# EAGLE design Longbow Widget (EAGLE 9.5.2)
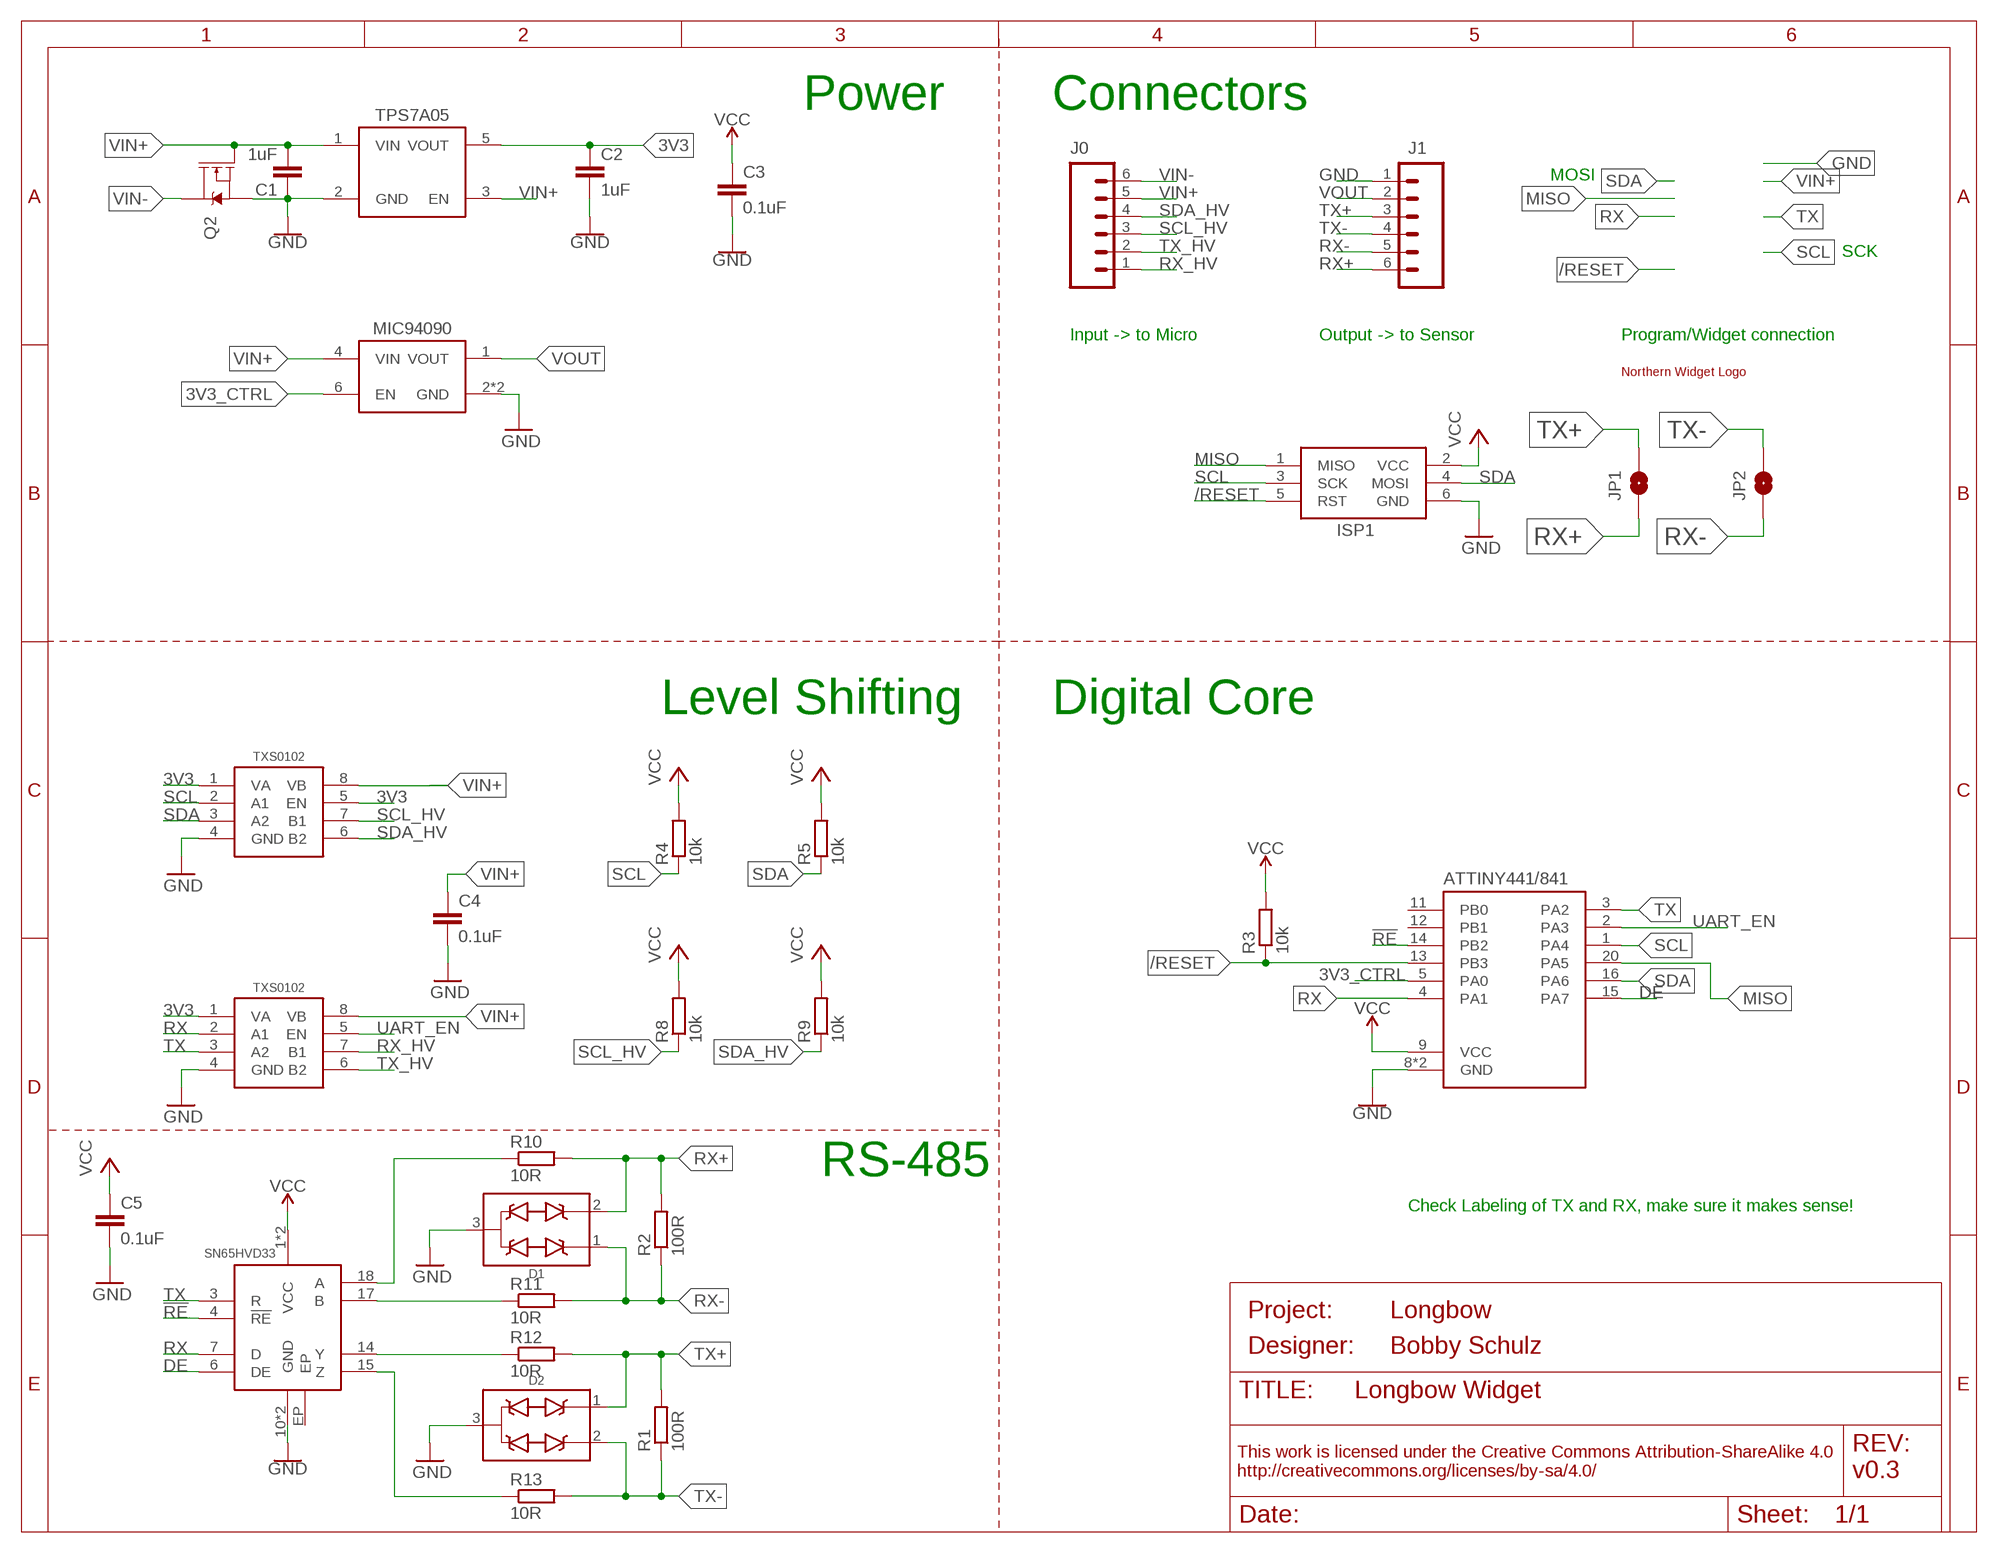
[diagram p0: schematic, sheet 1]
FRAME1 (FRAME_A_L): DESIGNER: Bobby Schulz; PROJECT: Longbow; REV: v0.3

## Parts
C1  1uF  C-EU1UFC0603  [C0603]
C2  1uF  C-EU1UFC0603  [C0603]
C3  0.1uF  C-EU0.1UFC0402  [C0402]
C4  0.1uF  C-EU0.1UFC0402  [C0402]
C5  0.1uF  C-EU0.1UFC0402  [C0402]
D1  TVSSM712  [SOT23-3]
D2  TVSSM712  [SOT23-3]
ISP1  AVRISP1.27MM  [2X3_1.27]
J0  CONN_6SCREW_2.54  [1X06_SCREW]
J1  CONN_6SCREW_2.54  [1X06_SCREW]
JP1  JUMPER-SMT_2_NO_SILK  [SMT-JUMPER_2_NO_SILK]
JP2  JUMPER-SMT_2_NO_SILK  [SMT-JUMPER_2_NO_SILK]
Q2  DMG3404  MOSFET-NCH-DMG3404L  [SOT23-3]
R1  100R  R-EU_100R0402  [R0402]
R2  100R  R-EU_100R0402  [R0402]
R3  10k  R-EU_10KR0402  [R0402]
R4  10k  R-EU_10KR0402  [R0402]
R5  10k  R-EU_10KR0402  [R0402]
R8  10k  R-EU_10KR0402  [R0402]
R9  10k  R-EU_10KR0402  [R0402]
R10  10R  R-EU_R0603  [R0603]
R11  10R  R-EU_R0603  [R0603]
R12  10R  R-EU_R0603  [R0603]
R13  10R  R-EU_R0603  [R0603]
U1  TPS7A0533DBV  [SOT23-5]
U2  SN65HVD33RHL  [VQFN-20_POWER]
U$1  MIC94090C6  [SC-70_6]
U$2  ATTINY441/841VQFN  [VQFN-20]
U$3  TXS0102DQM  [DQM_R-PX2SON-N8]
U$4  NWLOGO_MED  [NWLOGO_MED]
U$6  TXS0102DQM  [DQM_R-PX2SON-N8]

## Nets
3V3: C2.1 C3.1 C5.1 ISP1.2(VCC) R3.2 R4.2 R5.2 U1.5(VOUT) U2.1(VCC) U2.20(VCC) U$2.9(VCC) U$3.1(VA) U$3.5(EN) U$6.1(VA) ; supply symbol labelled VCC
3V3_CTRL: U$1.6(EN) U$2.5(PA0)
!RE: U2.4(!RE) U$2.14(PB2)
/RESET: ISP1.5(RST) R3.1 U$2.13(PB3)
DE: U2.6(DE) U$2.15(PA7)
GND: C1.1 C2.2 C3.2 C4.2 C5.2 D1.3(COM) D2.3(COM) ISP1.6(GND) J1.1 Q2.2(S) U1.2(GND) U2.10(GND) U2.11(GND) U$1.2(GND) U$1.5(GND) U$2.8(GND) U$2.EP(GND) U$3.4(GND) U$6.4(GND)
MISO: ISP1.1(MISO) U$2.20(PA5)
N$2: R10.1 U2.18(A)
N$5: R11.1 U2.17(B)
N$6: R12.1 U2.14(Y)
N$7: R13.1 U2.15(Z)
RX: U2.7(D) U$2.4(PA1) U$6.2(A1)
RX+: D1.2(D2) J1.6 JP1.1 R2.2 R10.2
RX-: D1.1(D1) J1.5 JP2.1 R2.1 R11.2
RX_HV: J0.1 U$6.7(B1)
SCL: ISP1.3(SCK) R4.1 U$2.1(PA4) U$3.2(A1)
SCL_HV: J0.3 R8.1 U$3.7(B1)
SDA: ISP1.4(MOSI) R5.1 U$2.16(PA6) U$3.3(A2)
SDA_HV: J0.4 R9.1 U$3.6(B2)
TX: U2.3(R) U$2.3(PA2) U$6.3(A2)
TX+: D2.1(D1) J1.3 JP1.2 R1.2 R12.2
TX-: D2.2(D2) J1.4 JP2.2 R1.1 R13.2
TX_HV: J0.2 U$6.6(B2)
UART_EN: U$2.2(PA3) U$6.5(EN)
VIN+: C1.2 C4.1 J0.5 Q2.1(G) R8.2 R9.2 U1.1(VIN) U1.3(EN) U$1.4(VIN) U$3.8(VB) U$6.8(VB) ; supply symbol labelled VCC
VIN-: J0.6 Q2.3(D)
VOUT: J1.2 U$1.1(VOUT)
Unconnected: U2.EP U$2.11(PB0) U$2.12(PB1)

## Notes on the sheet
- Power | Connectors
- MOSI
- SCK
- Input -> to Micro | Output -> to Sensor | Program/Widget connection
- Level Shifting | Digital Core
- RS-485
- Check Labeling of TX and RX, make sure it makes sense!

## Library data of the parts
C1 C2 = bschulz_passives:C-EU: CAPACITOR, European symbol; DIGIKEY: 490-10479-1-ND; MF: Murata; MPN: GRM188R61C105KA12D
C3-C5 = bschulz_passives:C-EU: CAPACITOR, European symbol; DIGIKEY: 490-4759-1-ND; MF: Murata; MPN: GCM155R71C104KA55D
D1 D2 = bschulz:TVS: Generic dual channel TVS diode; DIGIKEY: CDSOT23-SM712CT-ND; MF: Bourns; MPN: CDSOT23-SM712
ISP1 = bschulz:AVRISP: AVR ISP HEADER Standard 6 pin header for AVR programming
J0 J1 = bschulz:CONN_6: Genaric 6 pin header; DIGIKEY: ED10565-ND; MF: OnShore; MPN: OSTVN06A150
JP1 JP2 = SparkFun-Jumpers:JUMPER-SMT_2_NO: Normally open jumper This jumper has two pads in close proximity to each other. Apply solder to close the connection. Round pads are easier to solder for beginners, but are a lot larger. SparkFun Product that uses the round pads: SparkFun EL Sequencer <https://www.sparkfun.com/products/12781>
Q2 = bschulz:MOSFET-NCH: N-channel MOSFETs Voltage controlled devices that allow control of high current outputs. SparkFun Products: SparkFun OpenScale <https://www.sparkfun.com/products/13261> SparkFun Digital Sandbox <https://www.sparkfun.com/products/12651> SparkFun Monster Moto Shield <https://www.sparkfun.com/products/10182> SparkFun MOSFET Power Controller <https://www.sparkfun.com/products/11214>; DIGIKEY: DMG3404L-7DICT-ND; MF: Diodes Incorporated; MPN: DMG3404L-7
R1 R2 = bschulz_passives:R-EU_: RESISTOR, European symbol Digikey Parts: Yageo, 0402 <https://www.digikey.com/products/en/resistors/chip-resistor-surface-mount/52?k=&pkeyword=&sf=0&FV=ffec1104%2Cfffc000d%2C1c0002%2C440067%2C1f140000%2Cffe00034%2C400004&quantity=&ColumnSort=0&page=1&stock=1&pageSize=25> Yageo, 0603 <https://www.digikey.com/products/en/resistors/chip-resistor-surface-mount/52?k=&pkeyword=&s=4356&s=47360&sf=0&FV=fffc000d%2C1c0002%2C142c040c%2C1f140000%2Cffe00034&quantity=10&ColumnSort=1000011&page=1&stock=1&pageSize=25> Panasonic, precision, 0603 <https://www.digikey.com/products/en/resistors/chip-resistor-surface-mount/52?FV=ffec4907%2Cfffc000a%2Cc0172%2C142c040c%2C1f140000%2Cffe00034%2C1c0002&quantity=100&ColumnSort=2085&page=1&stock=1&pageSize=25> Vishay, pulse proof automotive <https://www.digikey.com/products/en/resistors/chip-resistor-surface-mount/52?k=&pkeyword=&pv7=2&sf=0&FV=ffec5d6b%2Cffe00034%2C1f140000&quantity=&ColumnSort=0&page=1&stock=1&pageSize=25>; DIGIKEY: 311-100LRCT-ND; MF: Yageo; MPN: RC0402FR-07100RL; VALUE_PART: 100
R3-R5 R8 R9 = bschulz_passives:R-EU_: RESISTOR, European symbol Digikey Parts: Yageo, 0402 <https://www.digikey.com/products/en/resistors/chip-resistor-surface-mount/52?k=&pkeyword=&sf=0&FV=ffec1104%2Cfffc000d%2C1c0002%2C440067%2C1f140000%2Cffe00034%2C400004&quantity=&ColumnSort=0&page=1&stock=1&pageSize=25> Yageo, 0603 <https://www.digikey.com/products/en/resistors/chip-resistor-surface-mount/52?k=&pkeyword=&s=4356&s=47360&sf=0&FV=fffc000d%2C1c0002%2C142c040c%2C1f140000%2Cffe00034&quantity=10&ColumnSort=1000011&page=1&stock=1&pageSize=25> Panasonic, precision, 0603 <https://www.digikey.com/products/en/resistors/chip-resistor-surface-mount/52?FV=ffec4907%2Cfffc000a%2Cc0172%2C142c040c%2C1f140000%2Cffe00034%2C1c0002&quantity=100&ColumnSort=2085&page=1&stock=1&pageSize=25> Vishay, pulse proof automotive <https://www.digikey.com/products/en/resistors/chip-resistor-surface-mount/52?k=&pkeyword=&pv7=2&sf=0&FV=ffec5d6b%2Cffe00034%2C1f140000&quantity=&ColumnSort=0&page=1&stock=1&pageSize=25>; DIGIKEY: 311-10KJRCT-ND; MF: Yageo; MPN: RC0402JR-0710KL; VALUE_PART: 10k
R10-R13 = bschulz_passives:R-EU_: RESISTOR, European symbol Digikey Parts: Yageo, 0402 <https://www.digikey.com/products/en/resistors/chip-resistor-surface-mount/52?k=&pkeyword=&sf=0&FV=ffec1104%2Cfffc000d%2C1c0002%2C440067%2C1f140000%2Cffe00034%2C400004&quantity=&ColumnSort=0&page=1&stock=1&pageSize=25> Yageo, 0603 <https://www.digikey.com/products/en/resistors/chip-resistor-surface-mount/52?k=&pkeyword=&s=4356&s=47360&sf=0&FV=fffc000d%2C1c0002%2C142c040c%2C1f140000%2Cffe00034&quantity=10&ColumnSort=1000011&page=1&stock=1&pageSize=25> Panasonic, precision, 0603 <https://www.digikey.com/products/en/resistors/chip-resistor-surface-mount/52?FV=ffec4907%2Cfffc000a%2Cc0172%2C142c040c%2C1f140000%2Cffe00034%2C1c0002&quantity=100&ColumnSort=2085&page=1&stock=1&pageSize=25> Vishay, pulse proof automotive <https://www.digikey.com/products/en/resistors/chip-resistor-surface-mount/52?k=&pkeyword=&pv7=2&sf=0&FV=ffec5d6b%2Cffe00034%2C1f140000&quantity=&ColumnSort=0&page=1&stock=1&pageSize=25>; DIGIKEY: 541-10.0SCT-ND; MF: Vishay; MPN: CRCW060310R0FKEAHP; VALUE_PART: 10
U1 = bschulz:TPS7A05*: TPS7A05* - Ultra Low Power Low Dropout Linear Regulator Characteristics: Vin: 1.4V ~ 5.5V Vout: 0.8, 1.0, 1.2, 1.5, 1.8, 2.5, 2.85, 3.3V fixed IQ: 1μA typ, 3μA max Voltage Accuracy: 1% typ, 3% max Output Current: 200 mA Operating Temperature: -40°C to 125°C Mouser: TPS7A0533 (3.3V Fixed) <https://www.mouser.com/ProductDetail/Texas-Instruments/TPS7A0533PDBVR?qs=sGAEpiMZZMsGz1a6aV8DcD1rpA6FsR3J1Mp5DdTpiXw%3d> TPS7A0518 (1.8V Fixed) <https://www.mouser.com/ProductDetail/Texas-Instruments/TPS7A0518PDBVR?qs=sGAEpiMZZMsGz1a6aV8DcD1rpA6FsR3J1f7DNYacdSI%3d>; DIGIKEY: 296-TPS7A0533PDBVRCT-ND; MF: TI; MOUSER: 595-TPS7A0533PDBVR; MPN: TPS7A0533PDBVR
U2 = bschulz:SN65HVD33: SN65HVD33 - Full Duplex RS-485 Tranciver, with output enable Characteristics: VCC: 3~3.6V Operating Temperature: -40°C to 85°C Signaling Rate: 1, 5, 26 Mbps (depending on model) Digikey: 296-24087-1-ND (RHL) <https://www.digikey.com/product-detail/en/texas-instruments/SN65HVD33RHLR/296-24087-1-ND/1991606> 296-18704-1-ND (D) <https://www.digikey.com/product-detail/en/texas-instruments/SN65HVD33DR/296-18704-1-ND/863533>; DIGIKEY: 296-24087-1-ND; MF: TI; MPN: SN65HVD33RHLR
U$1 = bschulz:MIC94090: MIC94090 - Hight Side Load Switch Characteristics: Vin: 1.7V ~ 5.5V IQ: 0.1μA typ, 1μA max RDS(ON): 130mΩ (Vin = 5v), 140mΩ (Vin = 3.6v) Output Current: 1.2 mA Operating Temperature: -40°C to 125°C Digikey: 576-3484-1-ND <https://www.digikey.com/products/en/integrated-circuits-ics/pmic-power-distribution-switches-load-drivers/726?k=mic94090&k=&pkeyword=mic94090&pv1291=38&sf=0&FV=ffe002d6%2C1c0002&quantity=&ColumnSort=0&page=1&stock=1&pageSize=25>; DIGIKEY: 576-3484-1-ND; MF: Microchip; MPN: MIC94090YC6-TR
U$2 = bschulz:ATTINY441/841: ATtiny841/441 8 bit AVR Microcontroller Features: (441/841) Vcc: 1.8 ~ 5.5V Clock: Up to 16MHz, Internal 8MHz FRC, 32kHz RC Flash Memory: 4/8K SRAM: 256/512B EEPROM: 256/512B ADC: 10b, 12 port USART: Yes, x2 SPI: Yes I2C: Yes, slave only Notes: 2 analog comp. Digikey: ATTINY841-MMHRCT-ND (VQFN) <https://www.digikey.com/product-detail/en/microchip-technology/ATTINY841-MMHR/ATTINY841-MMHRCT-ND/4437440> ATTINY841-SSU-ND (SOIC) <https://www.digikey.com/product-detail/en/microchip-technology/ATTINY841-SSU/ATTINY841-SSU-ND/4437435>; DIGIKEY: ATTINY841-MMHRCT-ND; MF: Atmel; MPN: ATTINY841-MMHR
U$3 U$6 = bschulz:TXS0102: TXS0102 - 2 Channel Bidirectional Voltage Level Translator Characteristics: Vcc: 1.65 ~ 3.6V (Port A), 2.3 ~ 5.5V (Port B) IQ: 14.4μA Output Current: 50mA Output Type: Open Drain/Push-Pull Operating Temperature: -40°C to 85°C Digikey: 296-28368-1-ND (DQE) <https://www.digikey.com/product-detail/en/texas-instruments/TXS0102DQER/296-28368-1-ND/2625893> 296-28435-1-ND (DQM) <https://www.digikey.com/product-detail/en/texas-instruments/TXS0102DQMR/296-28435-1-ND/2638910> 296-21931-1-ND (DCU) <https://www.digikey.com/product-detail/en/texas-instruments/TXS0102DCUR/296-21931-1-ND/1629284>; DIGIKEY: 296-28435-1-ND; MF: TI; MPN: TXS0102DQMR
U$4 = awickert:NWLOGO_MED: Medium-sized Northern Widget logo

## Board
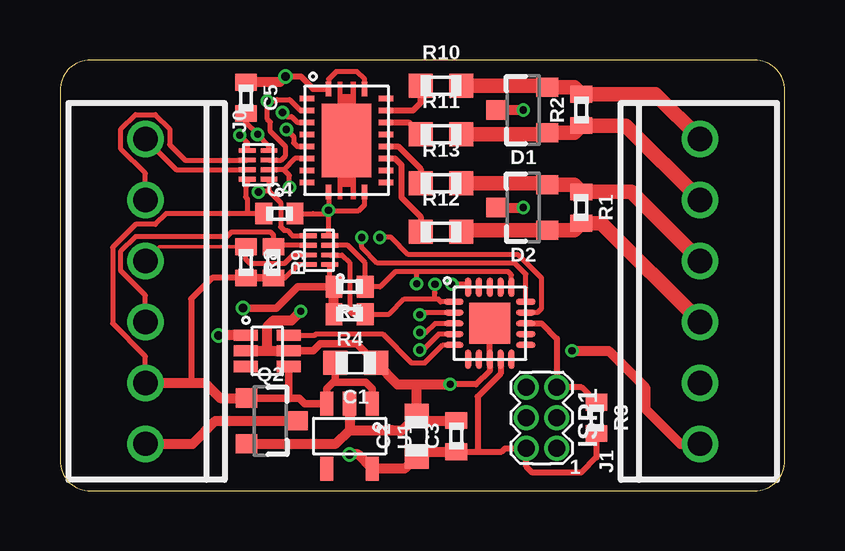
[diagram p1: board, top side]
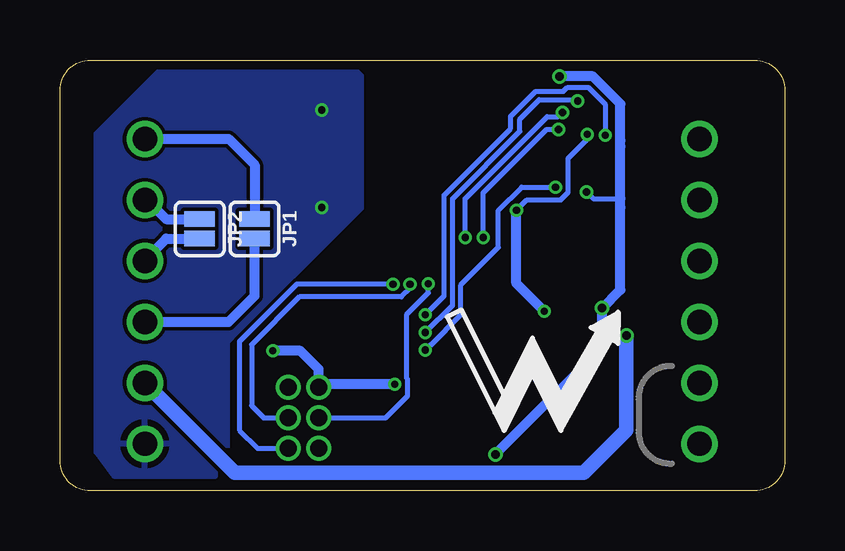
[diagram p2: board, bottom side, seen from below]

Size 30.21 x 17.96 mm. Coordinates in mm from the lower left corner, seen from the top.
Outline: 1.27,0 28.94,0 arc90 30.21,1.27 30.21,16.69 arc90 28.94,17.96 1.27,17.96 arc90 0,16.69 0,1.27 arc90 1.27,0
Copper layers (1*16): Top 0.035559375mm / dielectric 1.6mm / Bottom 0.035559375mm
Design rules "oshpark-2layer": minimum track width 6mil, minimum drill 10mil, track to track 6mil, track to pad 6mil, pad to pad 6mil, via to via 6mil, smd to smd 6mil, copper to edge 15mil, drill to drill 6mil, minimum pad ring 5mil, minimum via ring 5mil, stop-mask expansion 2.5mil, vias tented up to drill 0mil, thermal gap 10mil

### Footprints (pad centres in the part's own frame; a part is rotated, then mirrored left to right if it is on the bottom)
C0603 = smd 1 x 1: 1 -0.85,0; 2 0.85,0
C0402 = smd 0.7 x 0.9: 1 -0.65,0; 2 0.65,0
SOT23-3 = smd 0.8 x 0.9: 1 -0.95,-1; 2 0.95,-1; 3 0,1.1
2X3_1.27 = drill 0.7 pad 1.05: 1 -1.27,-0.635; 2 -1.27,0.635; 3 0,-0.635; 4 0,0.635; 5 1.27,-0.635; 6 1.27,0.635
1X06_SCREW = drill 1.016: 1 -6.35,0; 2 -3.81,0; 3 -1.27,0; 4 1.27,0; 5 3.81,0; 6 6.35,0
SMT-JUMPER_2_NO_SILK = smd 0.635 x 1.27: 1 -0.406,0; 2 0.406,0
R0402 = smd 0.7 x 0.9: 1 -0.65,0; 2 0.65,0
R0603 = smd 1 x 1: 1 -0.85,0; 2 0.85,0
SOT23-5 = smd 0.55 x 1: 1 -0.95,-1.35; 2 0,-1.35; 3 0.95,-1.35; 4 0.95,1.35; 5 -0.95,1.35
VQFN-20_POWER = smd 0.24 x 0.6: 1 -0.75,2.15; 10 -0.75,-2.15; 11 0.75,-2.15; 20 0.75,2.15 | smd 0.6 x 0.24: 2 -1.65,1.75; 3 -1.65,1.25; 4 -1.65,0.75; 5 -1.65,0.25; 6 -1.65,-0.25; 7 -1.65,-0.75; 8 -1.65,-1.25; 9 -1.65,-1.75; 12 1.65,-1.75; 13 1.65,-1.25; 14 1.65,-0.75; 15 1.65,-0.25; 16 1.65,0.25; 17 1.65,0.75; 18 1.65,1.25; 19 1.65,1.75 | smd 2.05 x 3.05: EP 0,0
SC-70_6 = smd 0.47 x 1: 1 -0.65,-0.9; 2 0,-0.9; 3 0.65,-0.9; 4 0.65,0.9; 5 0,0.9; 6 -0.65,0.9
VQFN-20 = smd 0.8 x 0.25: 1 -1.5,0.9; 2 -1.5,0.45; 3 -1.5,0; 4 -1.5,-0.45; 5 -1.5,-0.9; 11 1.5,-0.9; 12 1.5,-0.45; 13 1.5,0; 14 1.5,0.45; 15 1.5,0.9 | smd 0.25 x 0.8: 6 -0.9,-1.5; 7 -0.45,-1.5; 8 0,-1.5; 9 0.45,-1.5; 10 0.9,-1.5; 16 0.9,1.5; 17 0.45,1.5; 18 0,1.5; 19 -0.45,1.5; 20 -0.9,1.5 | smd 1.7 x 1.7: EP 0,0
DQM_R-PX2SON-N8 = smd 0.2 x 0.7: 1 -0.6,-0.45; 2 -0.2,-0.45; 3 0.2,-0.45; 4 0.6,-0.45; 5 0.6,0.45; 6 0.2,0.45; 7 -0.2,0.45; 8 -0.6,0.45

### Placement (x,y rotation side)
C1  12.32,5.33 180 top
C2  14.86,2.29 90 top
C3  16.51,2.29 90 top
C4  9.14,11.56 0 top
C5  7.75,16.38 270 top
D1  19.3,15.88 90 top
D2  19.3,11.81 90 top
ISP1  20.07,3.05 90 top
J0  3.56,8.32 270 top
J1  26.67,8.32 90 top
JP1  22.1,10.92 270 bottom
JP2  24.38,10.92 270 bottom
Q2  8.76,2.92 270 top
R1  21.72,11.81 270 top
R2  21.72,15.88 90 top
R3  22.35,3.05 270 top
R4  12.06,7.37 180 top
R5  12.06,8.51 180 top
R8  7.75,9.52 270 top
R9  8.89,9.52 270 top
R10  15.88,16.89 0 top
R11  15.88,14.86 0 top
R12  15.88,10.8 0 top
R13  15.88,12.83 0 top
U1  12.06,2.29 180 top
U2  11.94,14.61 0 top
U$1  8.64,5.84 270 top
U$2  17.91,6.98 0 top
U$3  10.79,10.03 90 top
U$4  10.54,5.46 0 bottom
U$6  8.26,13.59 90 top

### Tracks (layer width: path | path; a pad name or v marks a point on that pad's centre or on a via)
3V3  (via drill 0.3 pad 0.4, 0.35)
  Top 0.2: R5.2 11.25,8.68 U$3.1 | U$6.1 8.71,12.5 | 8.71,12.5 9.19,12.02 9.19,11 9.34,10.86 9.46,10.86 9.69,10.63 U$3.5 | v8.27,12.46 8.31,12.5 8.71,12.5 | U2.20 12.69,17.16 12.37,17.48 12.32,17.48 11.51,17.48 11.19,17.16 U2.1
  Top 0.254: U$2.9 18.36,4.89 17.4,3.94 17.4,1.65 17.4,1.64 | C3.1 16.89,1.64 17.4,1.64 | R3.2 22.35,1.4 21.72,0.76 19.69,0.76 19.43,1.02 ISP1.2 18.54,1.78 18.4,1.64 17.4,1.64 | v9.4,17.27 10.03,17.27 10.55,16.75 U2.1
  Top 0.305: v7.62,7.62 9.02,7.62 9.91,8.51 R5.2
  Top 0.406: C3.1 15.06,1.64 C2.1 14.36,0.94 U1.5 12.43,1.52 v12.06,1.52 | R4.2 R5.2 | v9.4,17.27 9.16,17.03 C5.1
  Bottom 0.2: v8.27,12.46 7.99,12.18 6.87,12.18 6.86,12.19
  Bottom 0.406: v12.06,1.52 7.62,5.97 v7.62,7.62 6.86,8.38 6.86,11.81 6.86,12.19 6.86,14.35 | 6.86,14.35 6.86,14.61 | 6.86,14.35 6.86,16.13 8,17.27 v9.4,17.27
3V3_CTRL
  Top 0.2: U$1.6 10.62,6.49 10.68,6.54 13.44,6.54 14.64,5.34 15.21,5.34 15.95,6.09 U$2.5
!RE  (via drill 0.3 pad 0.4)
  Top 0.2: v9.27,15.77 9.45,15.59 9.65,15.59 9.89,15.36 U2.4 | U$2.14 19.89,7.43 20.06,7.6 20.06,8.88 19.09,9.85 14.52,9.85 13.8,10.56 v13.32,10.56
  Bottom 0.2: v9.27,15.77 9.45,15.59 9.9,15.59 13.32,12.18 v13.32,10.56
/RESET
  Top 0.254: R3.1 21.73,4.32 ISP1.5 20.7,6.35 20.07,6.98 U$2.13
DE  (via drill 0.3 pad 0.4)
  Top 0.2: U$2.15 19.41,9.03 18.94,9.5 13.23,9.5 12.57,10.15 v12.57,10.56 | v9.43,15.07 9.74,14.76 9.74,14.5 9.88,14.36 U2.6
  Bottom 0.2: v12.57,10.56 12.57,12.43 9.93,15.07 v9.43,15.07
GND  (via drill 0.3, 0.3 pad 0.4)
  Top 0.2: C4.2 10.54,11.56 11.05,11.56 11.18,11.68 | 11.18,11.68 12.45,11.68 12.69,11.93 U2.11 | U2.10 v11.19,11.7 | v11.19,11.7 11.18,11.68 | 7.75,15.49 C5.2 7.75,15.35 v8.23,14.86 8.71,14.39 U$6.4 | U$3.4 11.19,10.69 v11.19,11.7
  Top 0.254: U$2.EP U$2.8 17.91,5.02 17.33,4.45 v16.26,4.45
  Top 0.305: U$1.5 10.55,5.84 10.84,6.14 12.36,6.14 C1.1 | 9.27,7.11 9.65,7.11
  Top 0.406: Q2.2 11.5,1.97 12.06,2.54 | 12.06,2.54 13.84,2.54 14.26,2.54 C2.2 | U1.2 12.06,2.54 | D2.3 v19.3,11.81 | D1.3 v19.3,15.88 | U$1.2 8,5.84 8.64,5.84 | 8.64,5.84 9.27,5.84 U$1.5 | C2.2 15.06,2.94 C3.2 | C1.1 14.06,4.45 14.86,4.45 | 14.86,4.45 v16.26,4.45 | C2.2 14.86,4.45 | v21.34,5.84 22.86,5.84 24.38,4.32 24.38,3.43 25.85,1.97 J1.1 | 8.64,5.84 8.64,6.86 8.89,7.11 9.27,7.11 9.65,7.11 v10.03,7.49
  Bottom 0.2: v8.23,14.86 8.23,14.65 9.03,13.86 9.03,12.44 9.34,12.13 10.76,12.13 v11.19,11.7
  Bottom 0.406: v16.26,4.45 19.3,4.45 ISP1.6 19.43,5.08 20.19,5.84 v21.34,5.84 | v10.03,7.49 11.19,8.65 v11.19,11.7
  pour Bottom: 17.65,17.27 17.91,17.53 26.04,17.53 28.7,14.86 28.7,1.65 27.94,0.63 23.75,0.63 23.24,1.14 23.24,6.22 17.65,11.81
MISO  (via drill 0.3 pad 0.4)
  Top 0.2: U$2.20 16.88,8.61 v16.33,8.61
  Bottom 0.2: v16.33,8.61 20.34,8.61 22.73,6.22 22.73,2.54 21.97,1.78 ISP1.1
N$2
  Top 0.254: U2.18 14.71,15.86 15.03,16.17 R10.1
N$5
  Top 0.254: U2.17 14.53,15.36 R11.1
N$6
  Top 0.254: U2.14 13.96,13.86 14.22,13.59 14.22,12.23 15.03,11.43 R12.1
N$7
  Top 0.254: U2.15 14.09,14.36 15.03,13.42 R13.1
RX  (via drill 0.3 pad 0.4)
  Top 0.2: U2.7 9.78,13.86 9.31,13.39 | 9.31,13.39 U$6.2 | U$2.4 15.78,6.54 15.11,5.87 v14.99,5.87 | v9.56,12.66 9.56,13.15 9.31,13.39
  Bottom 0.2: v14.99,5.87 14.78,6.07 14.77,6.07 13.5,7.34 13.5,8.59 11.94,10.15 11.94,11.7 10.97,12.66 v9.56,12.66
RX+
  Top 0.61: R10.2 20.24,16.89 D1.2 21.42,16.82 R2.2 24.81,16.52 J1.6
  Bottom 0.406: J1.6 23.18,14.67 22.1,13.59 JP1.1
RX-
  Top 0.61: R11.2 20.24,14.86 D1.1 21.42,14.93 R2.1 23.57,15.23 J1.5
  Bottom 0.406: J1.5 26.58,12.13 25.78,11.33 JP2.1
RX_HV
  Top 0.2: J0.1 4.83,13.39 U$6.7
SCL  (via drill 0.3 pad 0.4)
  Top 0.2: U$3.2 11.76,9.83 12.06,9.52 12.06,7.49 12.19,7.37 R4.1 13.72,7.37 14.35,8 15.62,8 | U$2.1 15.86,7.89 15.75,8 15.62,8 | 15.62,8 15.62,8.25 v15.62,8.61
  Bottom 0.2: ISP1.3 21.72,3.05 22.23,3.56 22.23,6.1 20.24,8.09 15.98,8.09 15.62,8.45 v15.62,8.61
SCL_HV
  Top 0.152: R8.1 4.14,10.18 J0.3
  Top 0.2: U$3.7 9.71,9.83 9.35,9.48 7.92,9.48 7.75,9.65 R8.1
SDA  (via drill 0.3 pad 0.4)
  Top 0.2: U$2.16 18.81,9.01 18.67,9.14 15.62,9.14 15.49,9.14 15.24,9.14 14.99,9.14 14.86,9.14 | U$3.3 11.99,10.23 12.72,9.51 R5.1 13.33,8.51 13.97,9.14 14.48,9.14 14.86,9.14 | v14.86,8.64 14.86,9.14
  Bottom 0.2: v14.86,8.64 14.86,8.25 15.75,7.37 15.75,4.69 15.73,4.66 15.73,3.96 16.64,3.05 ISP1.4
SDA_HV
  Top 0.2: J0.4 3.56,8.15 2.54,9.17 2.54,10.01 3.14,10.6 6.96,10.6 7.15,10.8 | 7.15,10.8 | 7.15,10.8 8.76,10.8 8.89,10.67 R9.1 8.95,10.23 U$3.6
TX  (via drill 0.3 pad 0.4)
  Top 0.2: U$6.3 9.22,13.79 9.4,13.97 9.4,14.35 8.76,14.99 8.76,15.37 8.64,15.49 v8.64,16.25 9,16.25 9.05,16.3 9.56,16.3 10.01,15.86 U2.3 | U$2.3 15.63,6.98 15.25,6.6 v14.99,6.6
  Bottom 0.2: v14.99,6.6 v14.98,6.6 13.85,7.73 13.85,12.18 11.05,14.98 11.05,15.49 10.24,16.3 8.69,16.3 v8.64,16.25
TX+
  Top 0.61: R12.2 16.79,10.86 D2.1 21.42,10.86 R1.2 22.56,11.16 J1.3
  Bottom 0.406: J1.3 23.18,7.05 22.1,8.13 JP1.2
TX-
  Top 0.61: R13.2 20.24,12.83 D2.2 21.42,12.76 R1.1 23.8,12.46 J1.4
  Bottom 0.406: J1.4 26.67,9.63 25.78,10.52 JP2.2
TX_HV
  Top 0.2: U$6.6 5.22,13.79 4.57,14.44 4.57,15.09 3.98,15.68 3.14,15.68 2.54,15.09 2.54,14.25 3.56,13.23 J0.2
UART_EN  (via drill 0.3 pad 0.4)
  Top 0.2: U$2.2 15.08,7.43 v14.99,7.34 | v7.49,14.83 7.8,14.51 U$6.5
  Bottom 0.2: v14.99,7.34 14.2,8.13 14.2,12.32 11.43,15.1 11.43,15.61 10.39,16.66 9.54,16.66 9.54,16.65 9.23,16.65 9.07,16.82 8.19,16.82 7.49,16.12 v7.49,14.83
VIN+
  Top 0.2: J0.5 3.56,5.61 2.19,6.98 2.19,10.15 3.15,11.11 3.98,11.11 4.42,11.56 7.75,11.56 | U$3.8 9.94,9.43 9.38,8.88 R9.2 | C4.1 7.75,11.56 | 7.75,11.56 7.8,11.61 7.8,12.17 7.74,12.24 7.74,12.68 7.8,12.75 U$6.8
  Top 0.254: R8.2 6.34,8.88 5.46,8 5.46,4.51
  Top 0.305: R8.2 R9.2 | Q2.1 9.53,3.87 | 9.53,3.87 9.97,3.87 10.21,3.64 U1.3 11.12,4.26 11.3,4.45 | U$1.4 9.53,5.18 9.53,3.87 | C1.2 11.47,4.61 11.3,4.45 | U1.1 13.01,4.26 12.74,4.53 11.39,4.53 11.3,4.45
  Top 0.406: J0.5 5.46,4.51 6.03,4.51 6.67,3.87 Q2.1
VIN-
  Top 0.406: J0.6 5.52,1.97 6.48,2.92 Q2.3
VOUT  (via drill 0.35)
  Top 0.406: U$1.1 6.62,6.49 v6.6,6.48
  Bottom 0.61: v6.6,6.48 6.6,2.54 8.38,0.76 22.92,0.76 J1.2

### Text on the board
tDocu: Longbow
bDocu: To Logger | To Sensor | Longbow Widget v0.3 / -------------- / Designed by / Northern Widget and / University of Minnesota | RX | RX+ | RX- | TX | 3.3v ~ 5v | SCL | J1 | J2 | TX- | TX+ | SDA | Vin | Vout | ± | GND | GND